# EAGLE schematic cryocooler_phase_lock (EAGLE 6.5.0)
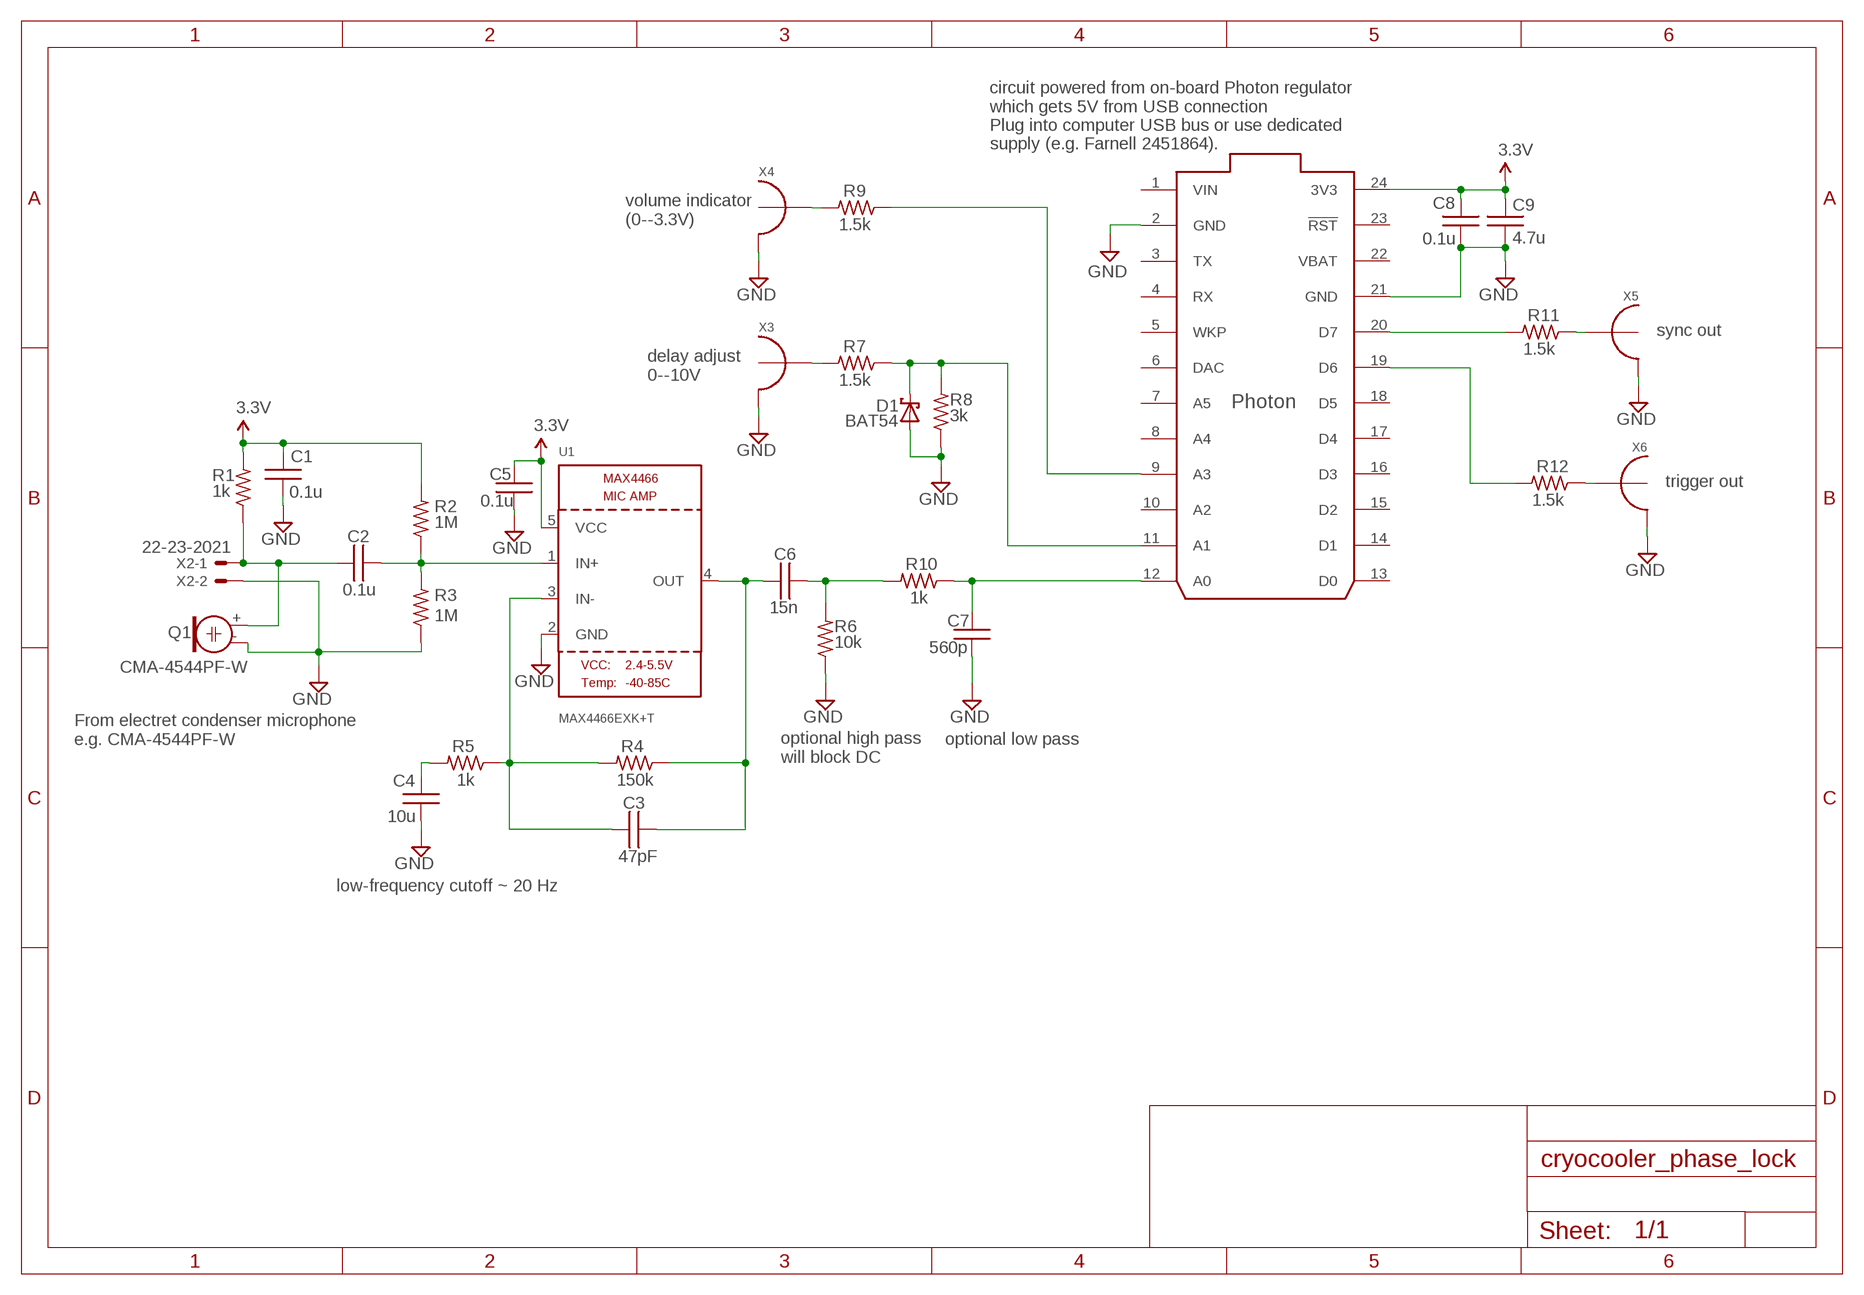
[diagram p0: schematic, sheet 1]

## Parts
C1  0.1u  C0603  [0603]
C2  0.1u  C0603  [0603]
C3  47pF  C0603  [0603]
C4  10u  C0603  [0603]
C5  0.1u  C0603  [0603]
C6  15n  C0603  [0603]
C7  560p  C0603  [0603]
C8  0.1u  C0603  [0603]
C9  4.7u  C0805  [0805]
D1  BAT54  [SOT23]
Q1  CMA-4544PF-W  ELECTRET  [ELECTRET_9.7]
R1  1k  R0603  [0603]
R2  1M  R0603  [0603]
R3  1M  R0603  [0603]
R4  150k  R0603  [0603]
R5  1k  R0603  [0603]
R6  10k  R0603  [0603]
R7  1.5k  R0603  [0603]
R8  3k  R0603  [0603]
R9  1.5k  R0603  [0603]
R10  1k  R0603  [0603]
R11  1.5k  R0603  [0603]
R12  1.5k  R0603  [0603]
U1  MAX4466EXK+T  MAX4466""  [SC70-5]
U3  PHOTON_WITH_HEADERS  [PHOTON]
X2  22-23-2021  [22-23-2021]
X3  BNC_VERTICAL  [BNC_VERTICAL]
X4  BNC_VERTICAL  [BNC_VERTICAL]
X5  BNC_VERTICAL  [BNC_VERTICAL]
X6  BNC_VERTICAL  [BNC_VERTICAL]

## Nets
3.3V: C1.1 C5.1 C8.1 C9.2 R1.2 R2.2 U1.5(VCC) U3.24(3V3)
AUDIO_IN: C3.2 C6.1 R4.1 U1.4(OUT)
DELAY_ADJUST: R7.2 X3.SIGNAL
GND: C1.2 C4.2 C5.2 C7.2 C8.2 C9.1 D1.1(A) Q1.- R3.1 R6.1 R8.1 U1.2(GND) U3.2(GND) U3.21(GND) X2.2 X3.GND X4.GND X5.GND X6.GND
N10: D1.3(C) R7.1 R8.2 U3.11(A1)
N$1: C2.1 Q1.+ R1.1 X2.1
N$2: C2.2 R2.1 R3.2 U1.1(IN+)
N$3: C3.1 R4.2 R5.1 U1.3(IN-)
N$4: C4.1 R5.2
N$5: C6.2 R6.2 R10.2
N$6: C7.1 R10.1 U3.12(A0)
N$9: R9.1 U3.9(A3)
N$10: R11.2 U3.20(D7)
N$12: R12.2 U3.19(D6)
SYNC_OUT: R11.1 X5.SIGNAL
TRIGGER_OUT: R12.1 X6.SIGNAL
VOLUME_INDICATOR: R9.2 X4.SIGNAL
Unconnected: U3.3(TX) U3.4(RX) U3.5(WKP) U3.6(DAC) U3.7(A5) U3.8(A4) U3.10(A2) U3.13(D0) U3.14(D1) U3.15(D2) U3.16(D3) U3.17(D4) U3.18(D5) U3.23(!RST)

## Notes on the sheet
- circuit powered from on-board Photon regulator
  which gets 5V from USB connection
  Plug into computer USB bus or use dedicated 
  supply (e.g. Farnell 2451864).
- volume indicator 
  (0--3.3V)
- sync out
- delay adjust 
  0--10V
- trigger out
- From electret condenser microphone
  e.g. CMA-4544PF-W
- optional low pass
- optional high pass
  will block DC
- low-frequency cutoff ~ 20 Hz

## Power pins joined to a net without a drawn wire
VBAT: U3.22(VBAT)
VIN: U3.1(VIN)

## Library data of the parts
C1-C9 = acrooptics:C: Capacitor
D1 = diode:BAT54: Schottky Diodes Source: Fairchild .. BAT54.pdf
Q1 = microbuilder:ELECTRET: Electret microphone Thru hole 2.54mm spacing with 9.7mm diameter
R1-R12 = acrooptics:R: 0603 resistor
U1 = microbuilder:MAX4466: MAX4466 - Microphone Pre-Amp
U3 = Spark:PHOTON
X2 = con-molex:22-23-2021: .100" (2.54mm) Center Header - 2 Pin; MF: MOLEX; MPN: 22-23-2021; OC_FARNELL: 1462926; OC_NEWARK: 25C3832
X3-X6 = noah:BNC_VERTICAL

## Net classes
1 standard: width 0.61 mm, clearance 0.254 mm